# EAGLE schematic control-tu56v6 (EAGLE 6.6.0)

## Sheet 1 of 3
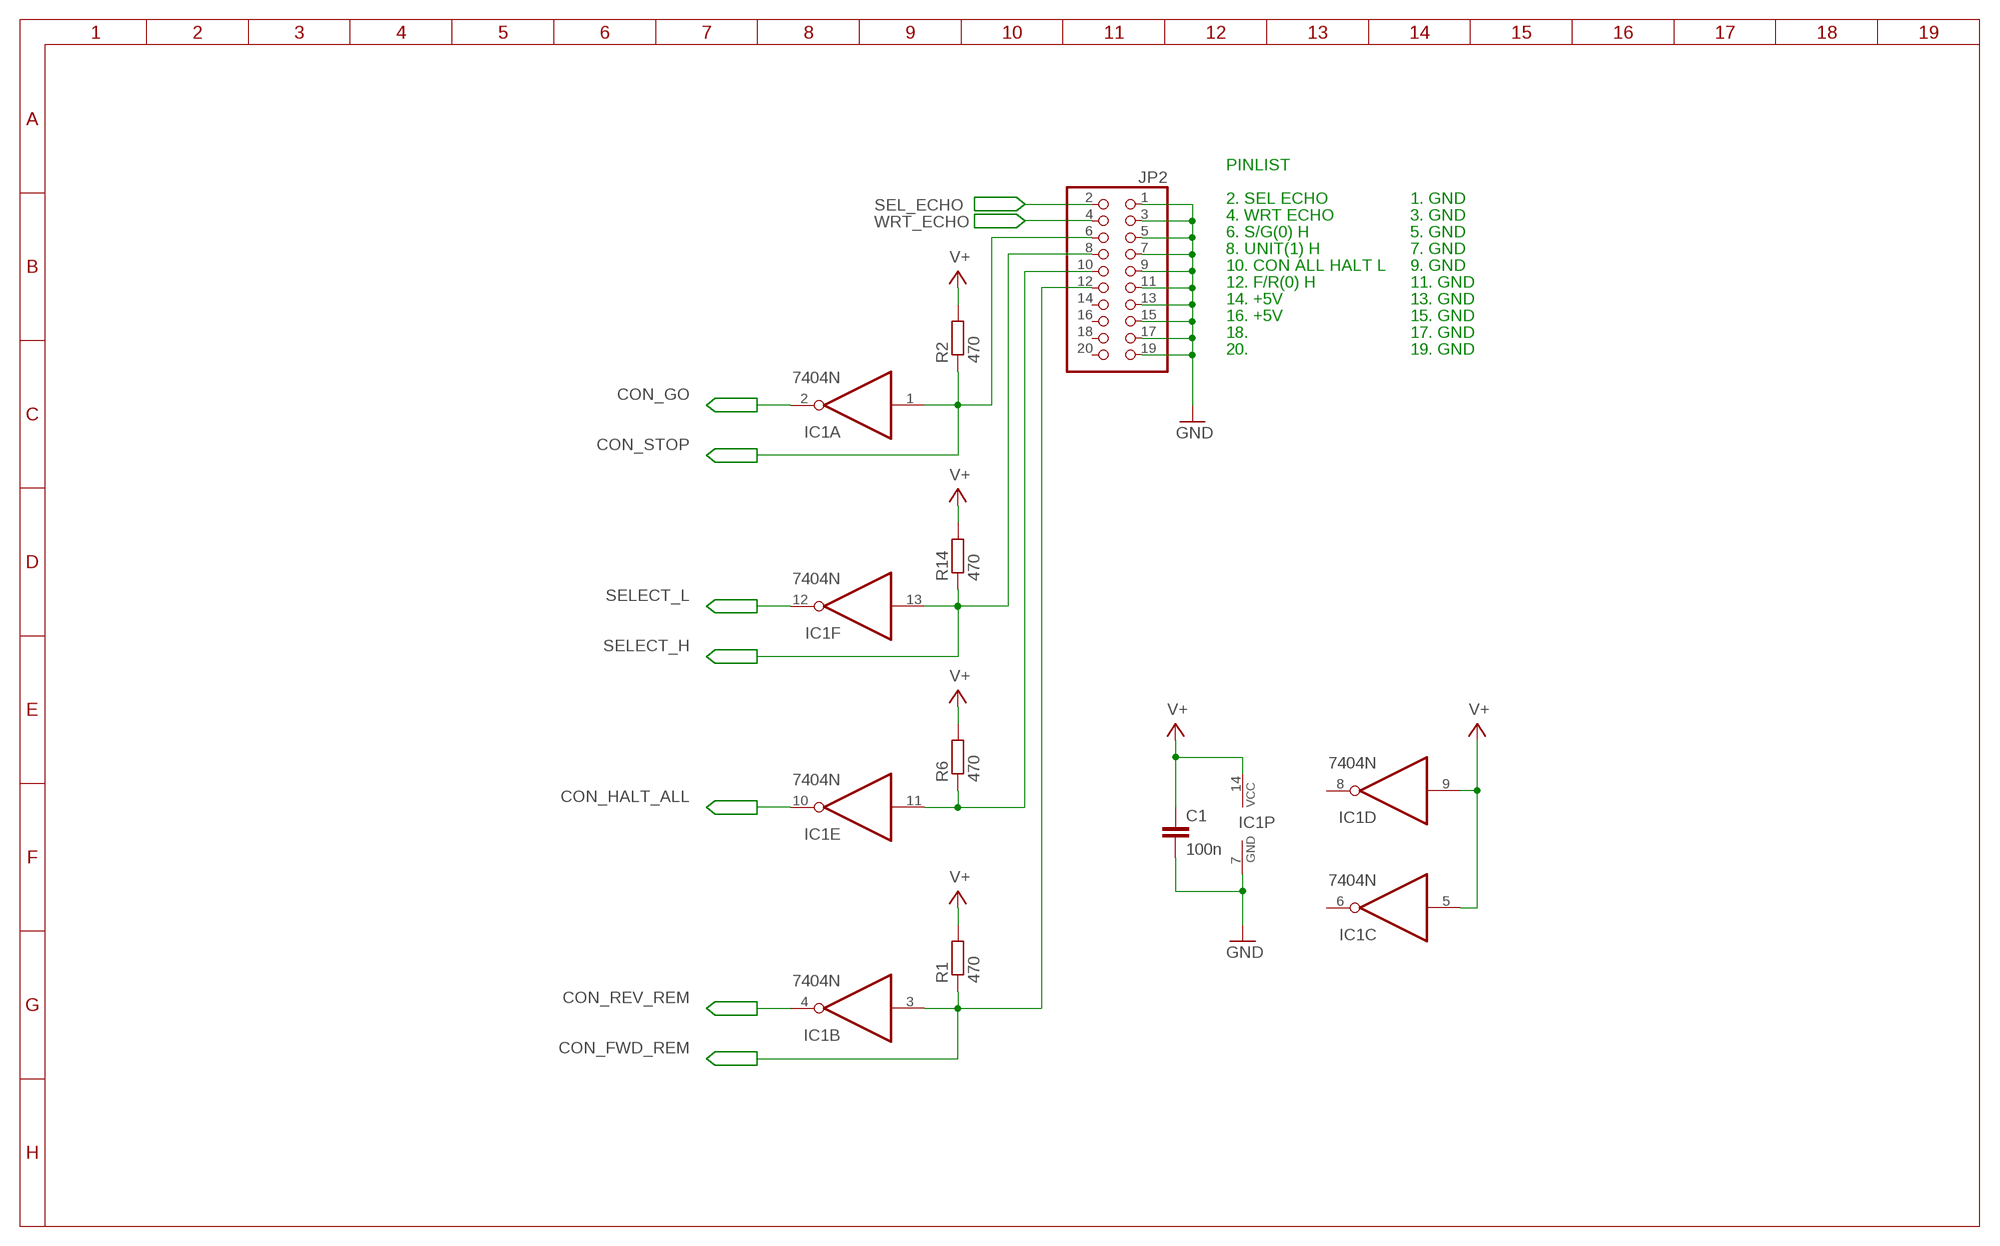
[diagram p0: schematic, sheet 1]

### Parts
C1  100n  C5/3.5  [C5B3.5]
IC1  7404N  [DIL14]
JP2  PINHD-2X10/90-FRAMED  [2Z10/90-FRAMED]
R1  470  R-EU_0207/10  [0207/10]
R2  470  R-EU_0207/10  [0207/10]
R6  470  R-EU_0207/10  [0207/10]
R14  470  R-EU_0207/10  [0207/10]

### Nets
CON_FWD_REM: IC1.3(B:I) JP2.12 R1.1 ; also sheet 3
CON_GO: IC1.2(A:O) ; also sheet 3
CON_HALT_ALL: IC1.10(E:O) ; also sheet 3
CON_REV_REM: IC1.4(B:O) ; also sheet 3
CON_STOP: IC1.1(A:I) JP2.6 R2.1 ; also sheet 3
GND: C1.2 IC1.7(P:GND) JP2.1 JP2.3 JP2.5 JP2.7 JP2.9 JP2.11 JP2.13 JP2.15 JP2.17 JP2.19 ; also sheet 3
N$4: IC1.11(E:I) JP2.10 R6.1
SEL_ECHO: JP2.2 ; also sheet 3
SELECT_H: IC1.13(F:I) JP2.8 R14.1 ; also sheet 2
SELECT_L: IC1.12(F:O) ; also sheet 2
V+: C1.1 IC1.5(C:I) IC1.9(D:I) IC1.14(P:VCC) R1.2 R2.2 R6.2 R14.2 ; also sheet 2,3
WRT_ECHO: JP2.4 ; also sheet 3
Unconnected: IC1.6(C:O) IC1.8(D:O) JP2.14 JP2.16 JP2.18 JP2.20

### Notes on the sheet
- PINLIST
- 2. SEL ECHO | 1. GND
- 4. WRT ECHO | 3. GND
- 6. S/G(0) H | 5. GND
- 8. UNIT(1) H | 7. GND
- 10. CON ALL HALT L | 9. GND
- 12. F/R(0) H | 11. GND
- 14. +5V | 13. GND
- 16. +5V | 15. GND
- 18. | 17. GND
- 20. | 19. GND

## Sheet 2 of 3
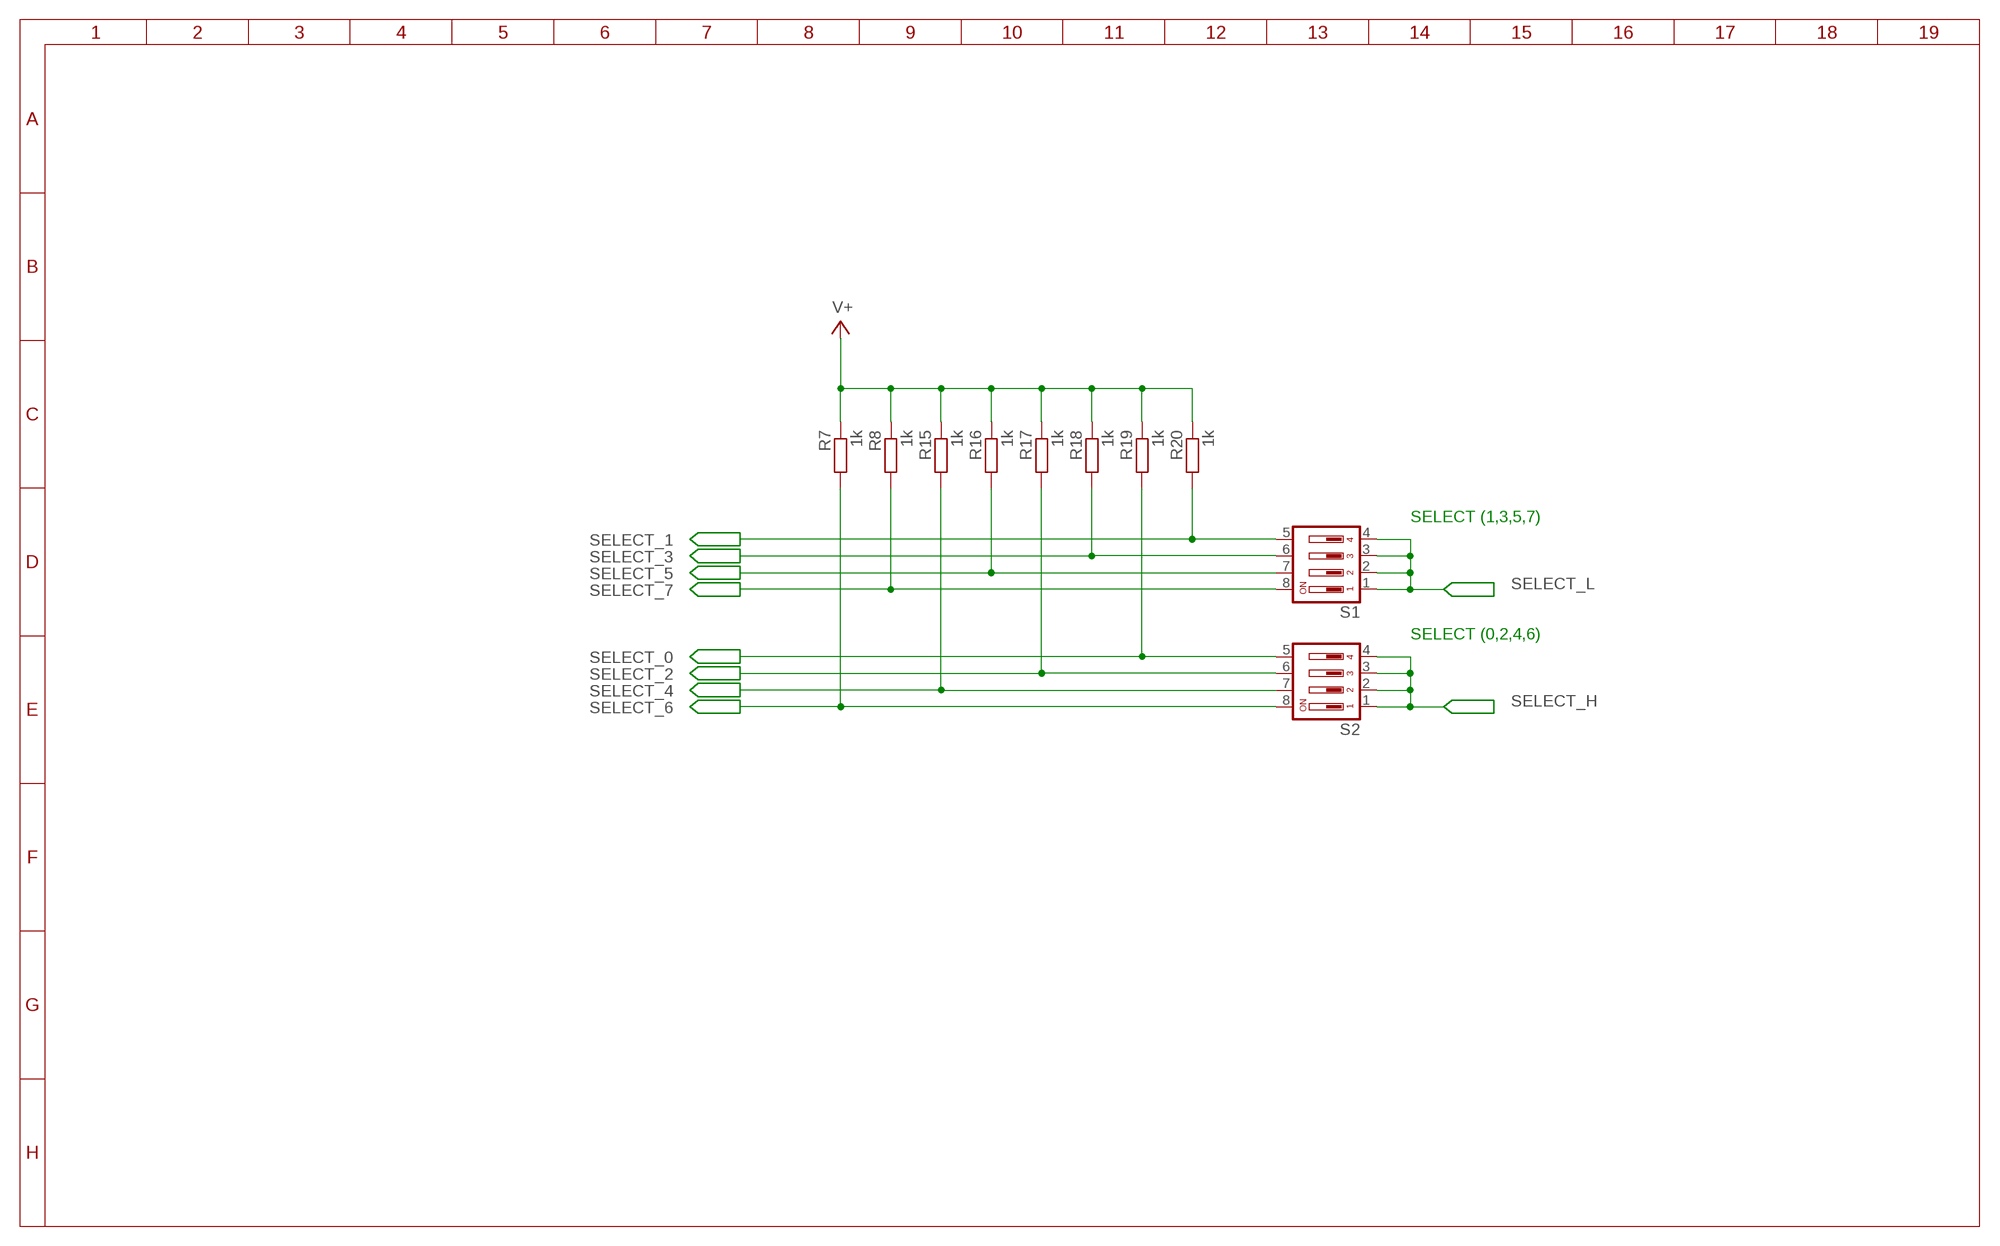
[diagram p1: schematic, sheet 2]

### Parts
R7  1k  R-EU_0207/10  [0207/10]
R8  1k  R-EU_0207/10  [0207/10]
R15  1k  R-EU_0207/10  [0207/10]
R16  1k  R-EU_0207/10  [0207/10]
R17  1k  R-EU_0207/10  [0207/10]
R18  1k  R-EU_0207/10  [0207/10]
R19  1k  R-EU_0207/10  [0207/10]
R20  1k  R-EU_0207/10  [0207/10]
S1  DIP04YL  [DIP04YL]
S2  DIP04YL  [DIP04YL]

### Nets
SELECT_0: R19.2 S2.5 ; also sheet 3
SELECT_1: R20.2 S1.5 ; also sheet 3
SELECT_2: R17.2 S2.6 ; also sheet 3
SELECT_3: R18.2 S1.6 ; also sheet 3
SELECT_4: R15.2 S2.7 ; also sheet 3
SELECT_5: R16.2 S1.7 ; also sheet 3
SELECT_6: R7.2 S2.8 ; also sheet 3
SELECT_7: R8.2 S1.8 ; also sheet 3
SELECT_H: S2.1 S2.2 S2.3 S2.4 ; also sheet 1
SELECT_L: S1.1 S1.2 S1.3 S1.4 ; also sheet 1
V+: R7.1 R8.1 R15.1 R16.1 R17.1 R18.1 R19.1 R20.1 ; also sheet 1,3

### Notes on the sheet
- SELECT (1,3,5,7)
- SELECT (0,2,4,6)

## Sheet 3 of 3
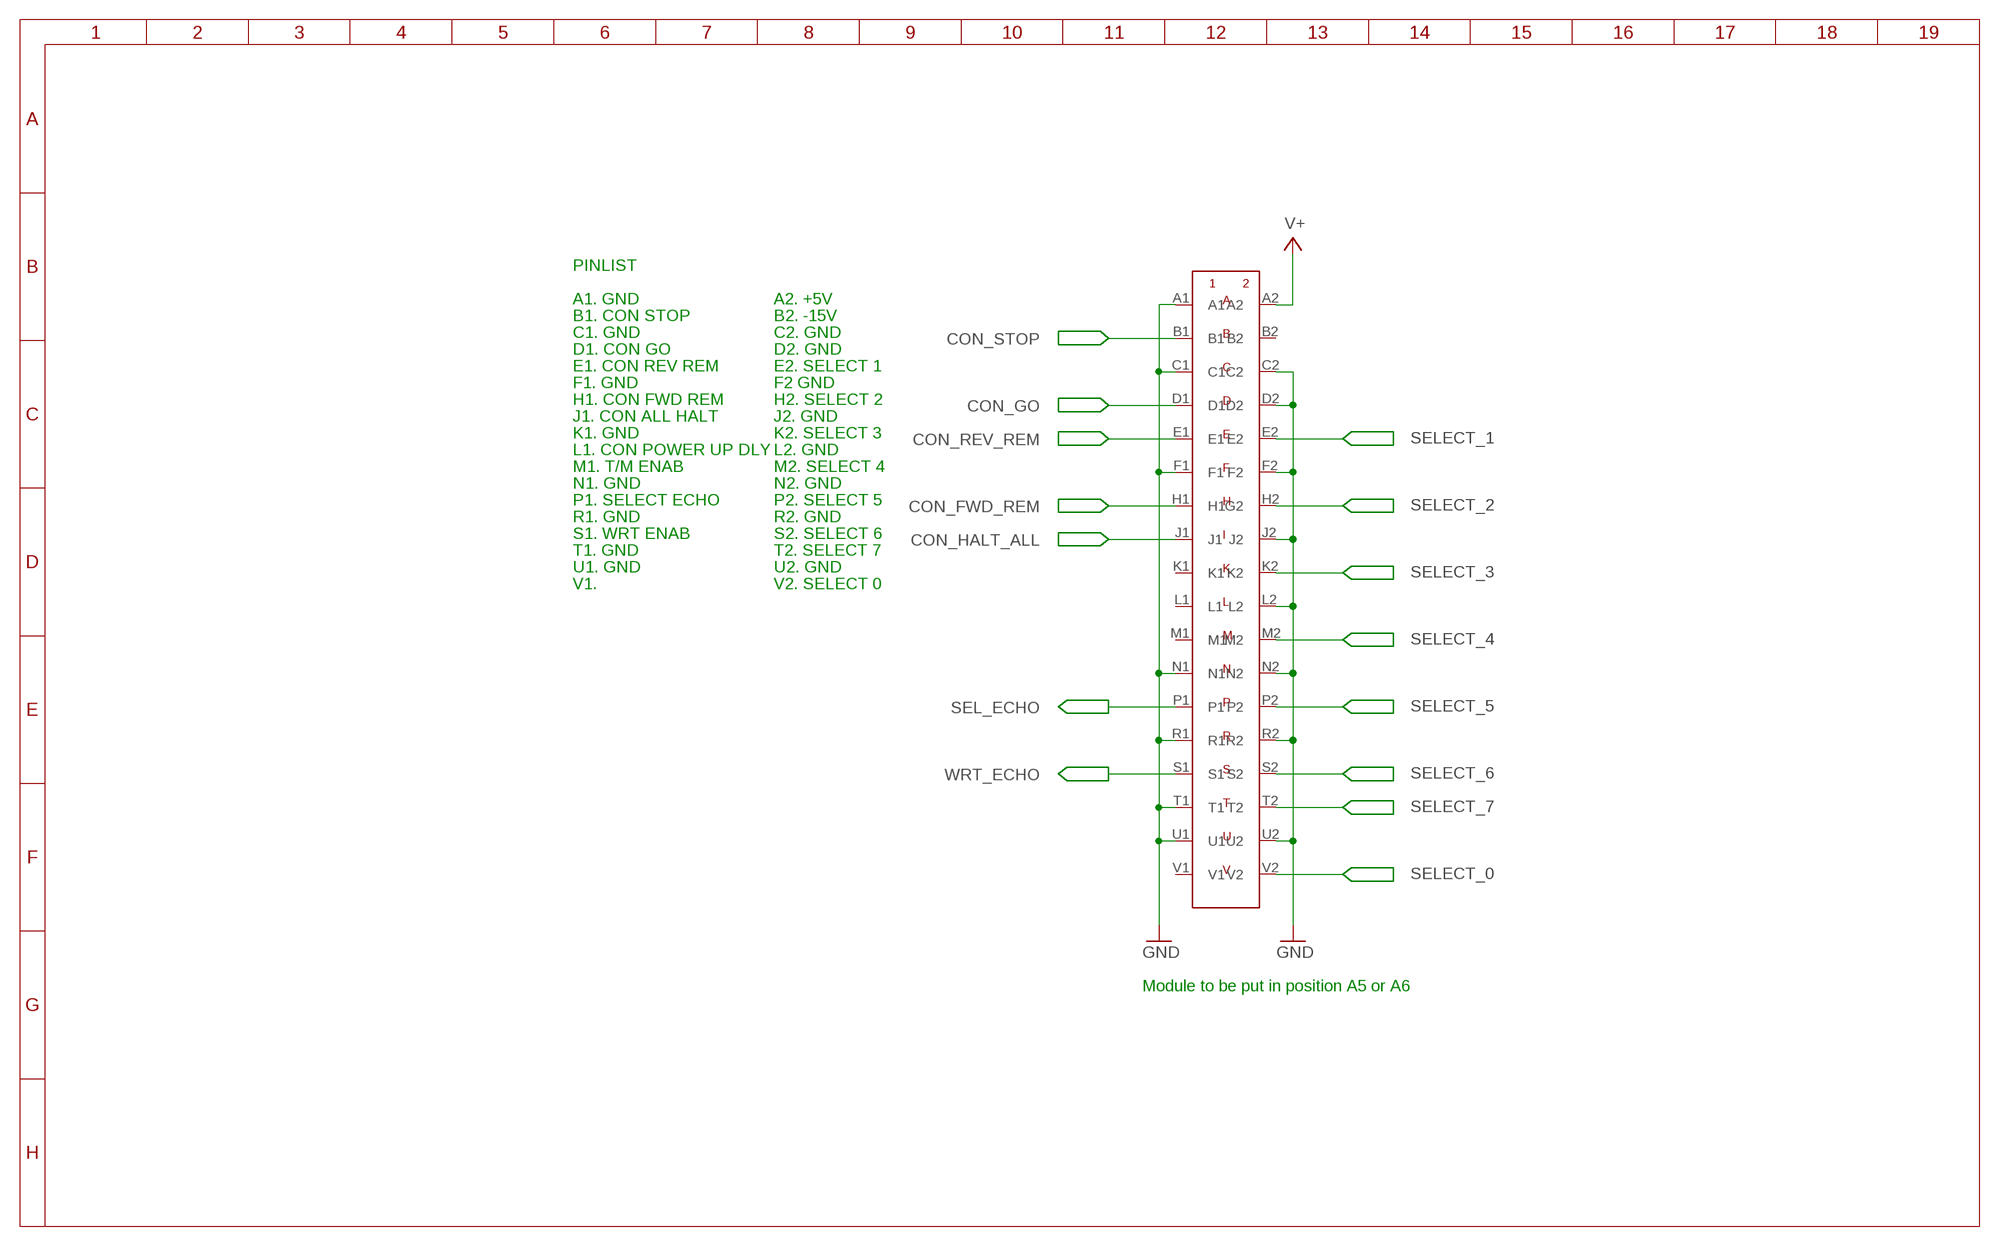
[diagram p2: schematic, sheet 3]

### Parts
CON1  FLIPCHIP_1NORMAL  [FLIPCHIP-1]

### Nets
CON_FWD_REM: CON1.H1 ; also sheet 1
CON_GO: CON1.D1 ; also sheet 1
CON_HALT_ALL: CON1.J1 ; also sheet 1
CON_REV_REM: CON1.E1 ; also sheet 1
CON_STOP: CON1.B1 ; also sheet 1
GND: CON1.A1 CON1.C1 CON1.C2 CON1.D2 CON1.F1 CON1.F2 CON1.J2 CON1.L2 CON1.N1 CON1.N2 CON1.R1 CON1.R2 CON1.T1 CON1.U1 CON1.U2 ; also sheet 1
SEL_ECHO: CON1.P1 ; also sheet 1
SELECT_0: CON1.V2 ; also sheet 2
SELECT_1: CON1.E2 ; also sheet 2
SELECT_2: CON1.H2(G2) ; also sheet 2
SELECT_3: CON1.K2 ; also sheet 2
SELECT_4: CON1.M2 ; also sheet 2
SELECT_5: CON1.P2 ; also sheet 2
SELECT_6: CON1.S2 ; also sheet 2
SELECT_7: CON1.T2 ; also sheet 2
V+: CON1.A2 ; also sheet 1,2
WRT_ECHO: CON1.S1 ; also sheet 1
Unconnected: CON1.B2 CON1.K1 CON1.L1 CON1.M1 CON1.V1

### Notes on the sheet
- PINLIST
- A1. GND | A2. +5V
- B1. CON STOP | B2. -15V
- C1. GND | C2. GND
- D1. CON GO | D2. GND
- E1. CON REV REM | E2. SELECT 1
- F1. GND | F2 GND
- H1. CON FWD REM | H2. SELECT 2
- J1. CON ALL HALT | J2. GND
- K1. GND | K2. SELECT 3
- L1. CON POWER UP DLY | L2. GND
- M1. T/M ENAB | M2. SELECT 4
- N1. GND | N2. GND
- P1. SELECT ECHO | P2. SELECT 5
- R1. GND | R2. GND
- S1. WRT ENAB | S2. SELECT 6
- T1. GND | T2. SELECT 7
- U1. GND | U2. GND
- V1. | V2. SELECT 0
- Module to be put in position A5 or A6

## Library data of the parts
C1 = anders:C: CAPACITOR naming: grid - package width
CON1 = anders:FLIPCHIP_1: DEC Digital equipment single flipchip
IC1 = 74xx-eu:74*04: Hex INVERTER
JP2 = pinhead:PINHD-2X10: PIN HEADER
R1 R2 R6-R8 R14-R20 = anders:R-EU_: RESISTOR, European symbol
S1 S2 = switch-dil:DIP04YL: DIL/CODE SWITCH